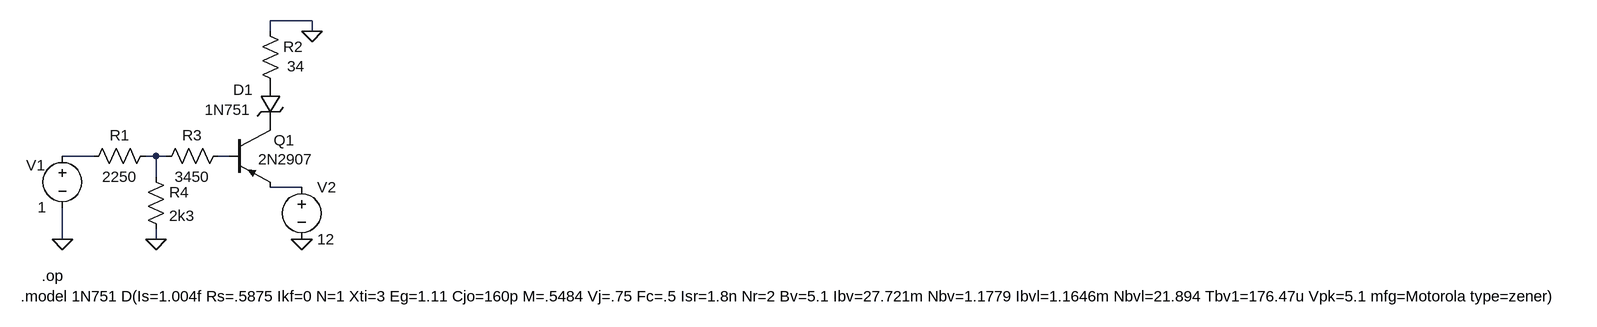
[diagram p0: schematic pnp3.asc]
pnp3.asc, the LTspice schematic file:
Version 4
SHEET 1 2500 680
WIRE 288 80 224 80
WIRE 224 96 224 80
WIRE 288 96 288 80
WIRE -48 288 -96 288
WIRE 48 288 32 288
WIRE 64 288 48 288
WIRE 160 288 144 288
WIRE 48 320 48 288
WIRE 272 336 224 336
WIRE -96 416 -96 368
WIRE 48 416 48 400
FLAG 288 96 0
FLAG -96 416 0
FLAG 48 416 0
FLAG 272 416 0
SYMBOL res 32 304 R0
SYMATTR InstName R4
SYMATTR Value 2k3
SYMBOL res 160 272 R90
WINDOW 0 0 56 VBottom 2
WINDOW 3 32 56 VTop 2
SYMATTR InstName R3
SYMATTR Value 3450
SYMBOL res 208 80 R0
WINDOW 3 42 70 Left 2
SYMATTR Value 34
SYMATTR InstName R2
SYMBOL voltage -96 272 R0
WINDOW 123 0 0 Left 0
WINDOW 39 0 0 Left 0
WINDOW 0 -56 30 Left 2
WINDOW 3 -38 95 Left 2
SYMATTR InstName V1
SYMATTR Value 1
SYMBOL pnp 160 240 R0
WINDOW 0 69 24 Left 2
WINDOW 3 45 53 Left 2
SYMATTR InstName Q1
SYMATTR Value 2N2907
SYMBOL res 48 272 R90
WINDOW 0 0 56 VBottom 2
WINDOW 3 32 56 VTop 2
SYMATTR InstName R1
SYMATTR Value 2250
SYMBOL voltage 272 320 R0
WINDOW 123 0 0 Left 0
WINDOW 39 0 0 Left 0
SYMATTR InstName V2
SYMATTR Value 12
SYMBOL zener 208 176 R0
WINDOW 0 -41 10 Left 2
WINDOW 3 -85 41 Left 2
SYMATTR InstName D1
SYMATTR Value 1N751
TEXT -128 472 Left 2 !.op
TEXT -160 504 Left 2 !.model 1N751 D(Is=1.004f Rs=.5875 Ikf=0 N=1 Xti=3 Eg=1.11 Cjo=160p M=.5484 Vj=.75 Fc=.5 Isr=1.8n Nr=2 Bv=5.1 Ibv=27.721m Nbv=1.1779 Ibvl=1.1646m Nbvl=21.894 Tbv1=176.47u Vpk=5.1 mfg=Motorola type=zener)

The netlist it stands for:
* pnp3.asc
R4 N002 0 2k3
R3 N003 N002 3450
R2 0 P001 34
V1 N001 0 1
Q1 P002 N003 N004 0 2N2907
R1 N002 N001 2250
V2 N004 0 12
D1 P001 P002 1N751
.model D D
.lib standard.dio
.model NPN NPN
.model PNP PNP
.lib standard.bjt
.op
.model 1N751 D(Is=1.004f Rs=.5875 Ikf=0 N=1 Xti=3 Eg=1.11 Cjo=160p M=.5484 Vj=.75 Fc=.5 Isr=1.8n Nr=2 Bv=5.1 Ibv=27.721m Nbv=1.1779 Ibvl=1.1646m Nbvl=21.894 Tbv1=176.47u Vpk=5.1 mfg=Motorola type=zener)
.backanno
.end